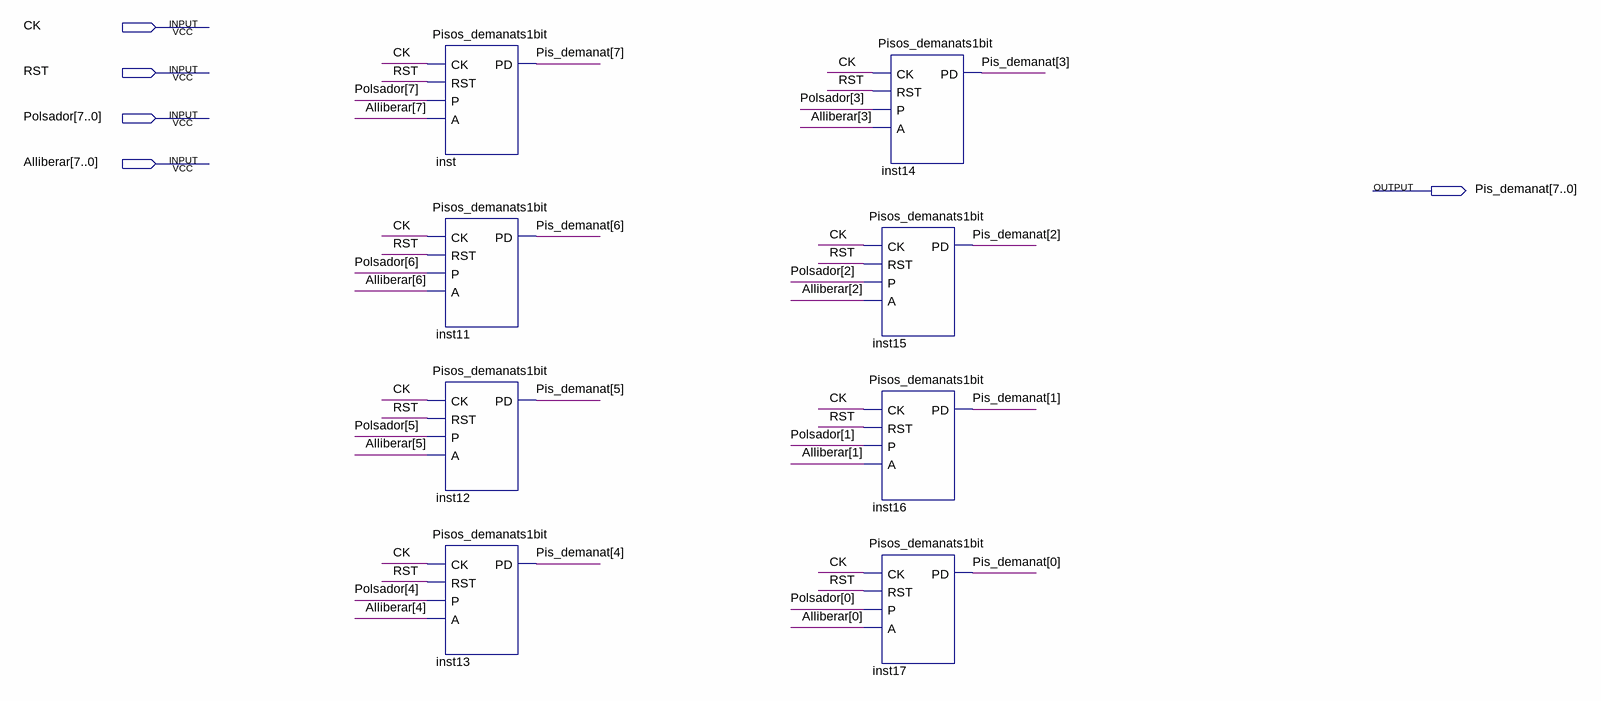
[diagram p0: schematic sheet]
// Quartus schematic Pisos_demanats.bdf as structural Verilog: 8 symbols, 5 pins
module Pisos_demanats (
  input  CK,
  input  RST,
  input  [7:0] Polsador,
  input  [7:0] Alliberar,
  output [7:0] Pis_demanat
);

  Pisos_demanats1bit inst (.CK(CK), .RST(RST), .P(Polsador[7]), .A(Alliberar[7]), .PD(Pis_demanat[7]));
  Pisos_demanats1bit inst11 (.CK(CK), .RST(RST), .P(Polsador[6]), .A(Alliberar[6]), .PD(Pis_demanat[6]));
  Pisos_demanats1bit inst12 (.CK(CK), .RST(RST), .P(Polsador[5]), .A(Alliberar[5]), .PD(Pis_demanat[5]));
  Pisos_demanats1bit inst13 (.CK(CK), .RST(RST), .P(Polsador[4]), .A(Alliberar[4]), .PD(Pis_demanat[4]));
  Pisos_demanats1bit inst15 (.CK(CK), .RST(RST), .P(Polsador[2]), .A(Alliberar[2]), .PD(Pis_demanat[2]));
  Pisos_demanats1bit inst16 (.CK(CK), .RST(RST), .P(Polsador[1]), .A(Alliberar[1]), .PD(Pis_demanat[1]));
  Pisos_demanats1bit inst17 (.CK(CK), .RST(RST), .P(Polsador[0]), .A(Alliberar[0]), .PD(Pis_demanat[0]));
  Pisos_demanats1bit inst14 (.CK(CK), .RST(RST), .P(Polsador[3]), .A(Alliberar[3]), .PD(Pis_demanat[3]));
endmodule
